# Altium schematic sheet 0805W8F1002T5E1_0805W8F1002T5E.schdoc
size 127 x 99 mm
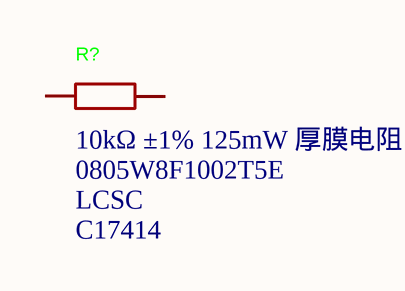
[diagram p0: 0805W8F1002T5E1_0805W8F1002T5E.schdoc]

## Parts
R?  LCSC Part Name: 10kΩ ±1% 125mW 厚膜电阻  Supplier Part: C17414  Supplier: LCSC  [R0805]  (hidden comment: 10kΩ)

## Nets

Not connected (* = marked no-connect by the designer): R? 1 2

## Library data of the parts
R? = 0805W8F1002T5E: Manufacturer: UNI-ROYAL(厚声); Add into BOM: yes; Tolerance: ±1%; Power(Watts): 125mW; Voltage-Supply(Max): 150V; Temperature Coefficient: ±100ppm/℃; Symbol: 0805W8F1002T5E; Device: 0805W8F1002T5E; Manufacturer Part: 0805W8F1002T5E; Value: 10kΩ; Supplier Footprint: 0805; JLCPCB Part Class: Basic Part; Datasheet: https://item.szlcsc.com/datasheet/0805W8F1002T5E/18102.html; Convert to PCB: yes; Type: Thick Film Resistor; Operating Temperature: -55℃~+155℃